# EAGLE design SL&R Overcurrent Analog (EAGLE 6.4)
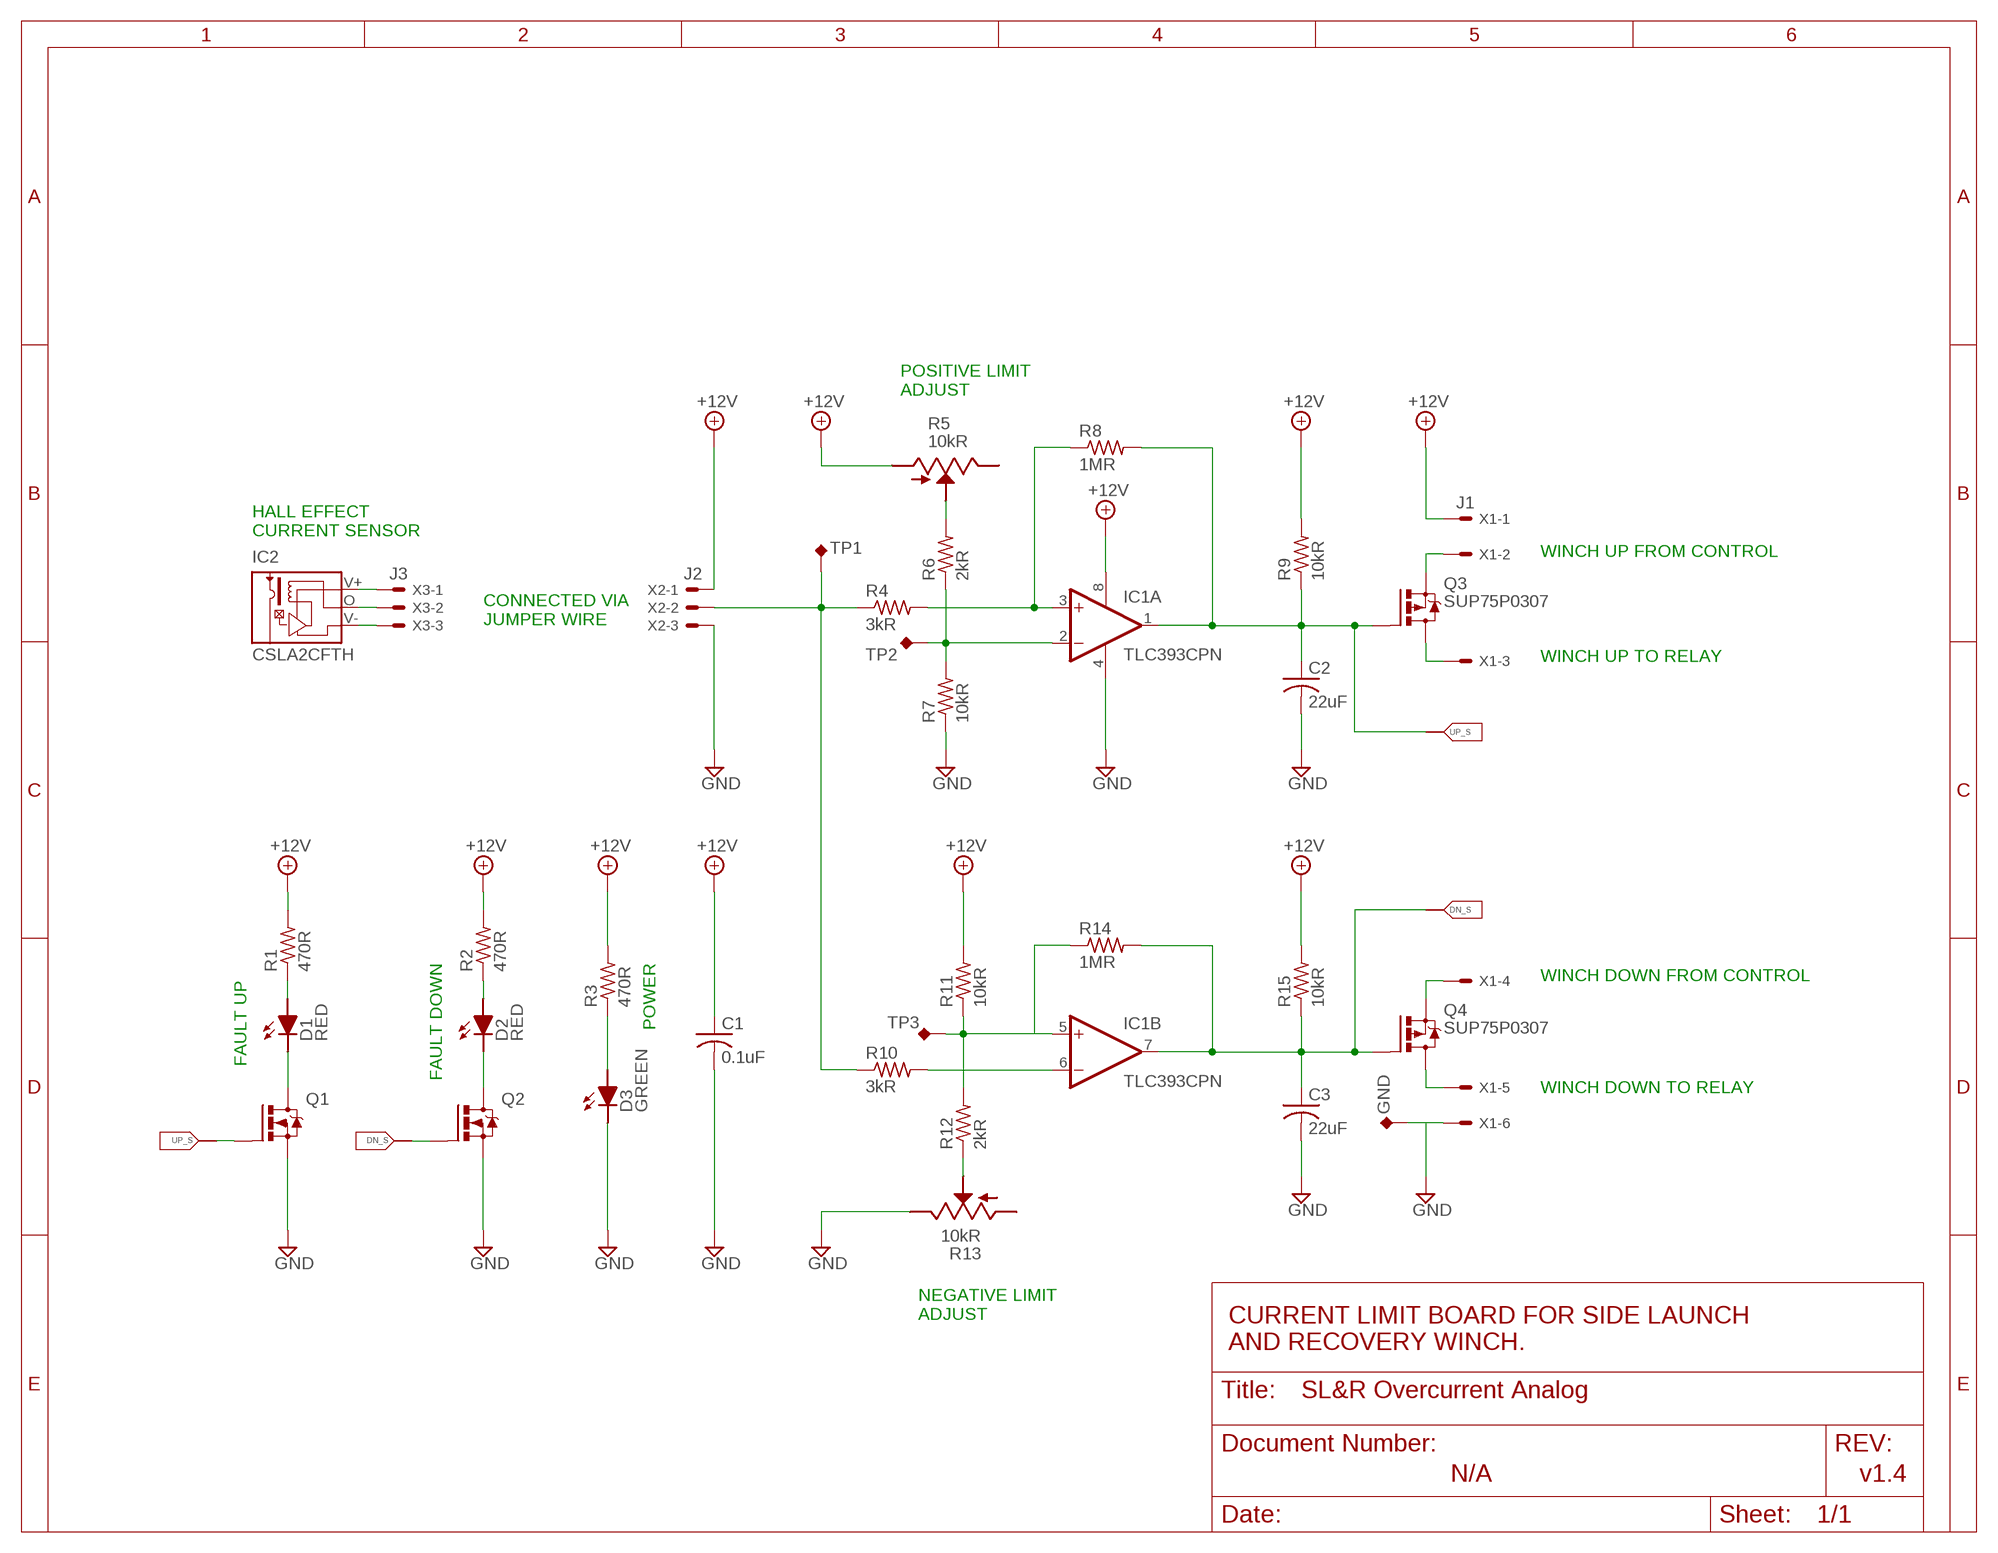
[diagram p0: schematic, sheet 1]

## Parts
C1  0.1uF  CAPACITOR-US  [C050-024X044]
C2  22uF  CAPACITOR-US025-050X050  [C025-050X050]
C3  22uF  CAPACITOR-US025-050X050  [C025-050X050]
D1  RED  LED  [LED5MM]
D2  RED  LED  [LED5MM]
D3  GREEN  LED  [LED5MM]
FRAME1  FRAME_A_L  [FRAME_A_L]
GND  TEST_POINT  [TESTLOOP]
IC1  TLC393CPN  [DIL08]
IC2  CSLA2CFTH  [CSLA2CF]
Q1  2N7000  [TO92-]
Q2  2N7000  [TO92-]
Q3  SUP75P0307  [TO220BV]
Q4  SUP75P0307  [TO220BV]
R1  470R  RESISTOR-US0204/7  [0204/7]
R2  470R  RESISTOR-US0204/7  [0204/7]
R3  470R  RESISTOR-US0204/7  [0204/7]
R4  3kR  RESISTOR-US0204/7  [0204/7]
R5  10kR  POT  [RTRIM3296W]
R6  2kR  RESISTOR-US0204/7  [0204/7]
R7  10kR  RESISTOR-US0204/7  [0204/7]
R8  1MR  RESISTOR-US0204/7  [0204/7]
R9  10kR  RESISTOR-US0204/7  [0204/7]
R10  3kR  RESISTOR-US0204/7  [0204/7]
R11  10kR  RESISTOR-US0204/7  [0204/7]
R12  2kR  RESISTOR-US0204/7  [0204/7]
R13  10kR  POT  [RTRIM3296W]
R14  1MR  RESISTOR-US0204/7  [0204/7]
R15  10kR  RESISTOR-US0204/7  [0204/7]
TP1  TEST_POINT  [TESTLOOP]
TP2  TEST_POINT  [TESTLOOP]
TP3  TEST_POINT  [TESTLOOP]
U$1  DOCFIELD  [DOCFIELD]
X1  J1  6PIN_HEADER  [22-23-2061]
X2  J2  22-23-2031  [22-23-2031]
X3  J3  22-23-2031  [22-23-2031]

## Nets
+12V: C1.1 IC1.8(P:V+) R1.2 R2.2 R3.2 R5.3 R9.2 R11.2 R15.2 X1.1 X2.1
GND: C1.2 C2.2 C3.2 D3.K(C) GND.P$1(TP) IC1.4(P:V-) Q1.3(S) Q2.3(S) R7.1 R13.1 X1.6 X2.3
N$1: IC1.3(A:+IN) R4.2 R8.1
N$2: IC1.2(A:-IN) R6.1 R7.2 TP2.P$1(TP)
N$3: D1.A R1.1
N$4: IC1.6(B:-IN) R10.2
N$5: IC1.5(B:+IN) R11.1 R12.2 R14.1 TP3.P$1(TP)
N$6: C2.1 IC1.1(A:OUT) Q1.2(G) Q3.G R8.2 R9.1
N$7: C3.1 IC1.7(B:OUT) Q2.2(G) Q4.G R14.2 R15.1
N$8: Q3.S X1.2
N$9: Q3.D X1.3
N$10: Q4.S X1.4
N$11: Q4.D X1.5
N$12: IC2.V+ X3.1
N$13: IC2.V- X3.3
N$14: IC2.O(M) X3.2
N$15: R4.1 R10.1 TP1.P$1(TP) X2.2
N$16: D1.K(C) Q1.1(D)
N$17: D2.A R2.1
N$18: D2.K(C) Q2.1(D)
N$19: D3.A R3.1
N$20: R5.2 R6.2
N$22: R12.1 R13.2
Unconnected: R5.1 R13.3

## Notes on the sheet
- POSITIVE LIMIT
  ADJUST
- HALL EFFECT
  CURRENT SENSOR
- WINCH UP FROM CONTROL
- CONNECTED VIA
  JUMPER WIRE
- WINCH UP TO RELAY
- FAULT DOWN | POWER
- FAULT UP | WINCH DOWN FROM CONTROL
- WINCH DOWN TO RELAY
- NEGATIVE LIMIT
  ADJUST
- CURRENT LIMIT BOARD FOR SIDE LAUNCH
  AND RECOVERY WINCH.
- N/A | v1.4

## Library data of the parts
C1-C3 = Overcurrent Detect:CAPACITOR-US: CAPACITOR, American symbol
D1-D3 = SL&R Overcurrent Analog:LED
FRAME1 = L&R Overcurrent Analog:FRAME_A_L: FRAME A Size , 8 1/2 x 11 INCH, Landscape
GND TP1-TP3 = SL&R Overcurrent Analog:TEST_POINT
IC1 = Overcurrent Detect:TLC393CP: COMPARATOR
IC2 = Overcurrent Detect:CSLA2CF: Current Transducer CSLA2CF For the electronic measurement of currents: DC, AC Source: Data sheet <http://sensing.honeywell.com/product%20page?pr_id=4790>
Q1 Q2 = SL&R Overcurrent Analog:2N7000
Q3 Q4 = Overcurrent Detect:SUP75P03: P-Channel Power MOSFET
R1-R3 = SL&R Overcurrent Analog:RESISTOR-US: RESISTOR, American symbol
R4 R6-R12 R14 R15 = Overcurrent Detect:RESISTOR-US: RESISTOR, American symbol
R5 R13 = SL&R Overcurrent Analog:POT
U$1 = L&R Overcurrent Analog:DOCFIELD
X1 = Overcurrent Detect:6PIN_HEADER: .100" (2.54mm) Center Header - 6 Pin; MF: MOLEX; MPN: 22-23-2061; OC_FARNELL: 1462922; OC_NEWARK: 27C1933
X2 X3 = Overcurrent Detect:22-23-2031: .100" (2.54mm) Center Header - 3 Pin; MF: MOLEX; MPN: 22-23-2031; OC_FARNELL: 1462950; OC_NEWARK: 30C0862

## Board
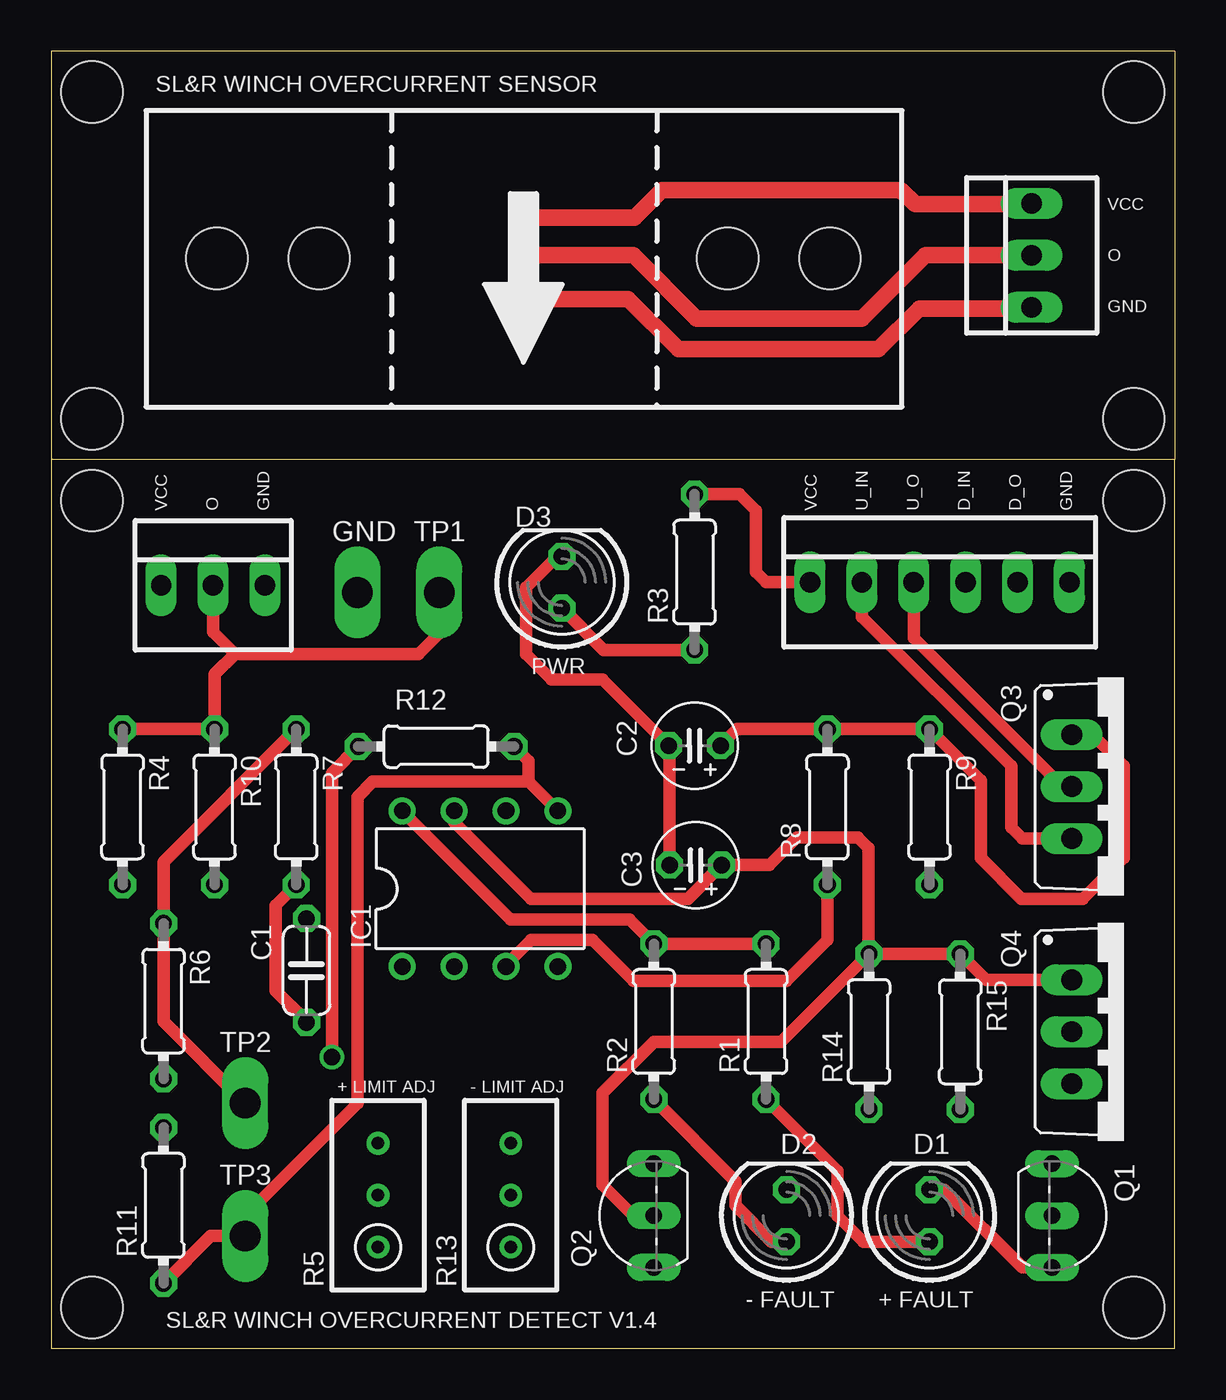
[diagram p1: board, top side]
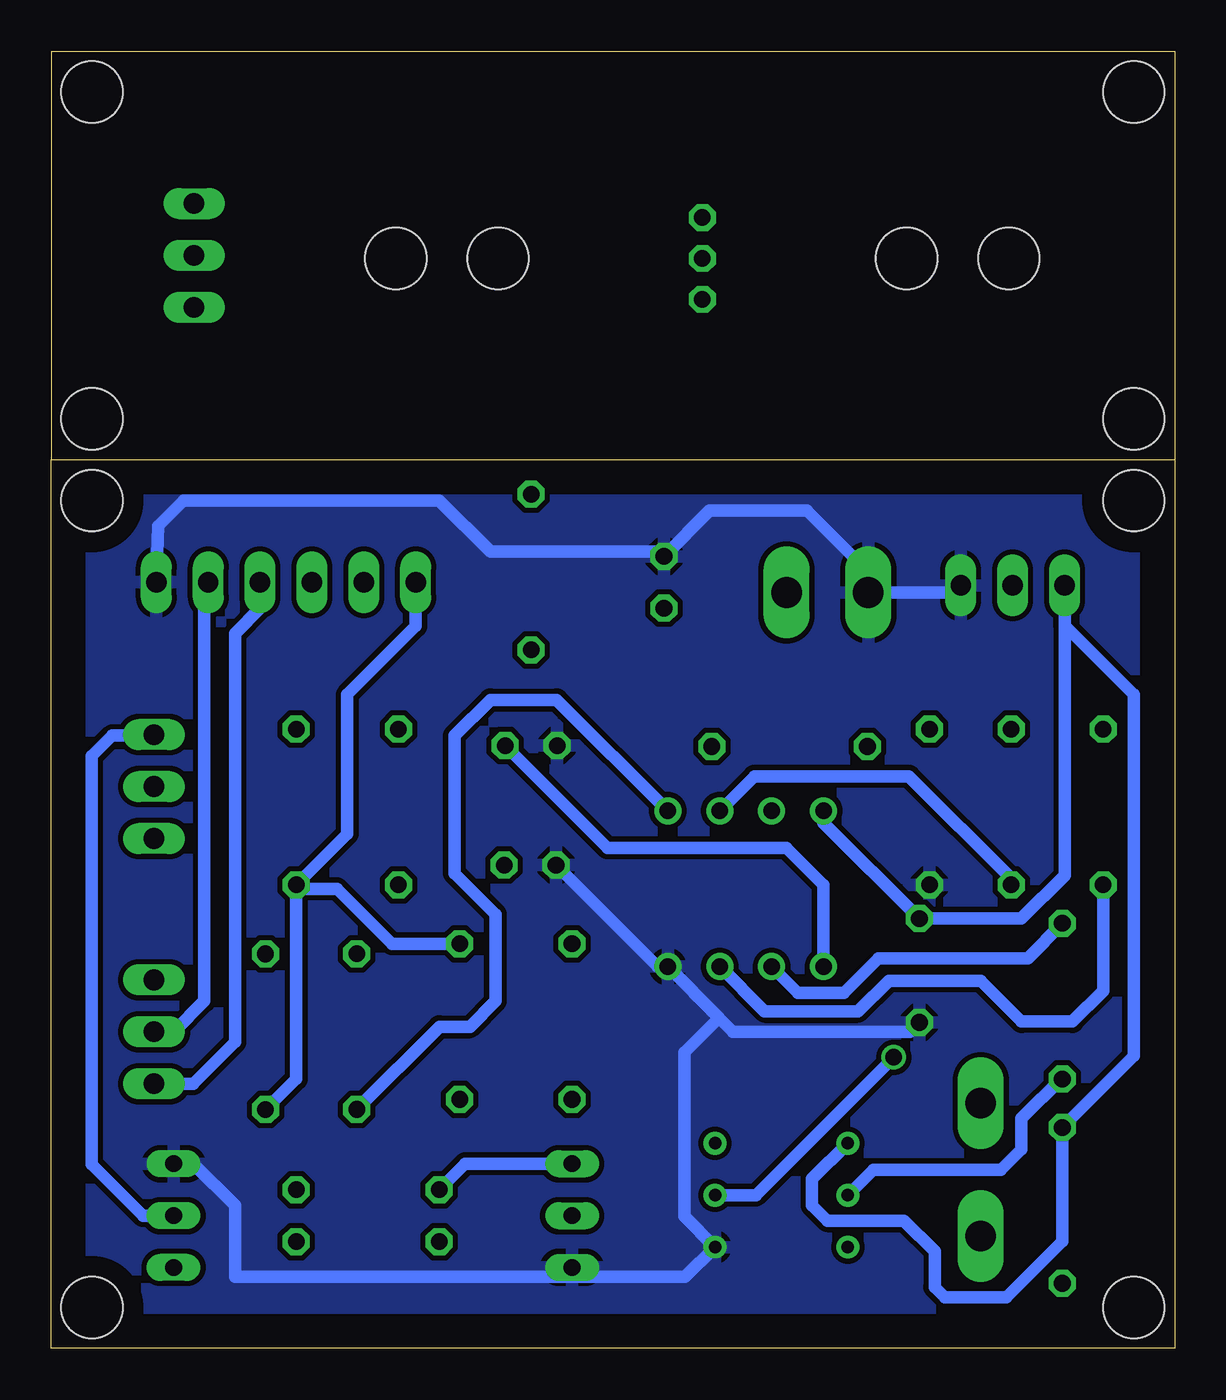
[diagram p2: board, bottom side, seen from below]

Size 55 x 63.5 mm. Coordinates in mm from the lower left corner, seen from the top.
Outline: 55,43.5 55,0 0,0 0,43.5
Outline: 55,43.5 55,63.5 0,63.5 0,43.5
Outline: 55,43.5 0,43.5
Copper layers (1*16): Top 0.035mm / dielectric 1.5mm / Bottom 0.035mm
Design rules "default *": minimum track width 10mil, minimum drill 24mil, track to track 10mil, track to pad 10mil, pad to pad 10mil, via to via 10mil, smd to smd 10mil, copper to edge 40mil, drill to drill 8mil, minimum pad ring 10mil, minimum via ring 8mil, stop-mask expansion 4mil, vias tented up to drill 0mil, thermal gap 10mil
Holes 3 mm at 53,2 2,2 2,41.5 53,41.5 2,45.5 2,61.5 53,61.5 53,45.5

### Footprints (pad centres in the part's own frame; a part is rotated, then mirrored left to right if it is on the bottom)
C050-024X044 = drill 0.813 octagon: 1 -2.54,0; 2 2.54,0
C025-050X050 = drill 0.813 octagon: 1 -1.27,0; 2 1.27,0
LED5MM = drill 0.813 octagon: A -1.27,0; K 1.27,0
TESTLOOP = drill 1.5 long: P$1 0,0
DIL08 = drill 0.813 pad 1.27: 1 -3.81,-3.81; 2 -1.27,-3.81; 3 1.27,-3.81; 4 3.81,-3.81; 5 3.81,3.81; 6 1.27,3.81; 7 -1.27,3.81; 8 -3.81,3.81
CSLA2CF = drill 0.8 octagon: O 0,0; V+ 0,-2; V- 0,2 | hole 3: -10,0; 10,0; 15,0; -15,0
TO92- = drill 0.813 long: 1 2.54,0; 2 0,0; 3 -2.54,0
TO220BV = drill 1.016 long: D 0,-2.54; G -2.54,-2.54; S 2.54,-2.54
0204/7 = drill 0.813 octagon: 1 -3.81,0; 2 3.81,0
RTRIM3296W = drill 0.61: 1 0,-2.54; 2 0,0; 3 0,2.54
22-23-2061 = drill 1 long: 1 -6.35,0; 2 -3.81,0; 3 -1.27,0; 4 1.27,0; 5 3.81,0; 6 6.35,0
22-23-2031 = drill 1 long: 1 -2.54,0; 2 0,0; 3 2.54,0

### Placement (x,y rotation side)
C1  12.5,18.5 270 top
C2  31.5,29.5 180 top
C3  31.55,23.66 180 top
D1  43,6.5 90 top
D2  36,6.5 90 top
D3  25,37.5 90 top
FRAME1  -112.51,-79.09 0 top  (outside the outline)
GND  15,37 0 top
IC1  21,22.5 0 top
IC2  23.12,53.35 0 top
Q1  49,6.5 270 top
Q2  29.5,6.5 90 top
Q3  52.5,27.5 270 top
Q4  52.5,15.5 270 top
R1  35,16 90 top
R2  29.5,16 90 top
R3  31.5,38 90 top
R4  3.5,26.5 270 top
R5  16,7.5 0 top
R6  5.5,17 270 top
R7  12,26.5 90 top
R8  38,26.5 90 top
R9  43,26.5 270 top
R10  8,26.5 270 top
R11  5.5,7 90 top
R12  18.85,29.46 0 top
R13  22.5,7.5 0 top
R14  40.04,15.51 90 top
R15  44.5,15.5 270 top
TP1  19,37 0 top
TP2  9.5,12 0 top
TP3  9.5,5.5 0 top
U$1  59.46,-79.01 0 top  (outside the outline)
X1  43.5,37.5 0 top
X2  7.93,37.35 0 top
X3  48,53.5 90 top

### Tracks (layer width: path | path; a pad name or v marks a point on that pad's centre or on a via)
+12V
  Top 0.61: IC1.8 22.5,21 28.31,21 R2.2 R1.2 | R3.2 33.69,41.81 34.5,41 34.5,38 35,37.5 X1.1
  Bottom 0.61: R9.2 40.5,25.19 40.5,32 37.15,35.35 X1.1 | R9.2 43,13.19 R15.2 | R1.2 38.31,19.81 41,22.5 42.81,22.5 R9.2 | IC1.8 17.19,25.73 C1.1 7.5,21.04 5.39,23.15 X2.1 5.39,35.39 2,32 2,14.31 R11.2 5.5,5.25 8.25,2.5 11.25,2.5 11.75,3 11.75,4.75 13.25,6.25 17,6.25 17.75,7 17.75,8.29 R5.3
GND
  Top 0.61: C3.2 30.28,29.45 C2.2 26.98,32.75 24.5,32.75 23.25,34 23.25,37.25 24.77,38.77 D3.K | R7.1 11,21.69 11,17.5 12.5,16 C1.2
  Bottom 0.61: Q1.3 48.04,9.04 46,7 46,3.5 29.96,3.5 | C3.2 25.32,18.69 IC1.4 22.31,16.19 | X1.6 49.75,40.25 48.5,41.5 36,41.5 33.5,39 25.23,39 D3.K 22.77,41 18,41 15,38 GND.P$1 10.82,37 X2.3 | 29.96,3.5 Q2.3 | 29.96,3.5 23.96,3.5 R13.1 24,6.46 24,14.5 22.31,16.19 | 22.31,16.19 21.62,15.5 12.96,15.5 C1.2
  pour Bottom: 53,2 2,2 2,41.5 53,41.5
N$1
  Top 0.61: IC1.3 22.27,18.77 23.5,20 26.5,20 28.5,18 36,18 38,20 R8.1
  Bottom 0.61: 22.19,18.69 IC1.3 20.08,16.5 15.5,16.5 14,18 9.5,18 7.5,16 5,16 3.5,17.5 R4.2
N$2
  Top 0.61: R7.2 5.5,23.81 R6.1 5.5,16 TP2.P$1
  Bottom 0.61: IC1.2 18.44,17.4 16.2,17.4 14.5,19.1 7.2,19.1 R6.1
N$3
  Top 0.61: R1.1 38.5,8.69 38.5,6.5 39.77,5.23 D1.A
N$4
  Bottom 0.61: R10.2 8,23 13,28 20.58,28 IC1.6
N$5
  Top 0.61: R11.1 7.81,5.5 TP3.P$1 9.5,6.5 15,12 15,27 15.75,27.75 23.37,27.75 | IC1.5 23.37,27.75 | R12.2 23.37,28.75 23.37,27.75
  Bottom 0.61: R14.1 35.99,15.75 34.5,15.75 33.25,17 33.25,21.25 35.25,23.25 35.25,30 33.5,31.75 30.25,31.75 IC1.5
N$6
  Top 0.61: C2.1 33.58,30.31 R8.2 R9.1 45.5,27.81 45.5,24 47.5,22 50.5,22 52.5,24 52.5,28.5 50.96,30.04 Q3.G
  Bottom 0.61: 32.5,29.5 C2.1 27.77,24.5 19,24.5 17.19,22.69 IC1.1 | Q1.2 50.5,6.5 53,9 53,29 52,30 50,30 Q3.G
N$7
  Top 0.61: R14.2 R15.1 45.77,18.04 Q4.G | R14.2 35.72,15 29.5,15 27,12.5 27,8 28.5,6.5 Q2.2 | R14.2 40,19.36 40,24.5 39.5,25 36.5,25 35.16,23.66 C3.1 31.17,22 23.5,22 19.73,25.77 IC1.7
N$8
  Top 0.61: Q3.S 47.54,24.96 47,25.5 47,28.5 39.69,35.81 X1.2
N$9
  Top 0.61: X1.3 42.23,34.77 49.5,27.5 Q3.D
N$10
  Bottom 0.61: X1.4 44.77,36.23 46,35 46,15 48.04,12.96 Q4.S
N$11
  Bottom 0.61: X1.5 47.5,37.31 47.5,17 49,15.5 Q4.D
N$12
  Top 0.813: IC2.V+ 28.25,51.35 30.7,48.9 40.5,48.9 42.5,50.9 47.94,50.9 X3.1
N$13
  Top 0.813: IC2.V- 28.55,55.35 29.9,56.7 41.6,56.7 42.3,56 47.96,56 X3.3
N$14
  Top 0.813: IC2.O 23.27,53.5 28.5,53.5 31.6,50.4 39.7,50.4 42.8,53.5 X3.2
N$15
  Top 0.61: X2.2 7.93,35.07 9,34 | 9,34 18,34 19,35 TP1.P$1 | 9,34 8,33 R10.1 R4.1
N$16
  Top 0.61: Q1.1 47.54,3.96 43.73,7.77 D1.K
N$17
  Top 0.61: R2.1 33.5,8.19 33.5,7 35.27,5.23 D2.A
N$18
  Bottom 0.61: Q2.1 34.73,9.04 D2.K
N$19
  Top 0.61: R3.1 27.04,34.19 D3.A
N$20
  Bottom 0.61: R6.2 5.5,13.25 7.5,11.25 7.5,9.75 8.5,8.75 14.75,8.75 R5.2
N$22  (via drill 0.8)
  Top 0.61: R12.1 13.75,28.17 v13.75,14.25
  Bottom 0.61: v13.75,14.25 20.5,7.5 R13.2

### Text on the board
tPlace: SL&R WINCH OVERCURRENT SENSOR | VCC | O | GND | VCC | O | GND | VCC | U_IN | U_O | D_IN | D_O | GND | PWR | + LIMIT ADJ | - LIMIT ADJ | - FAULT | + FAULT | SL&R WINCH OVERCURRENT DETECT V1.4
Document: CURRENT LIMIT BOARD FOR SIDE LAUNCH / AND RECOVERY WINCH. | N/A | v1.4 | 1/1